# Altium schematic sheet ne5555.schdoc
size A4
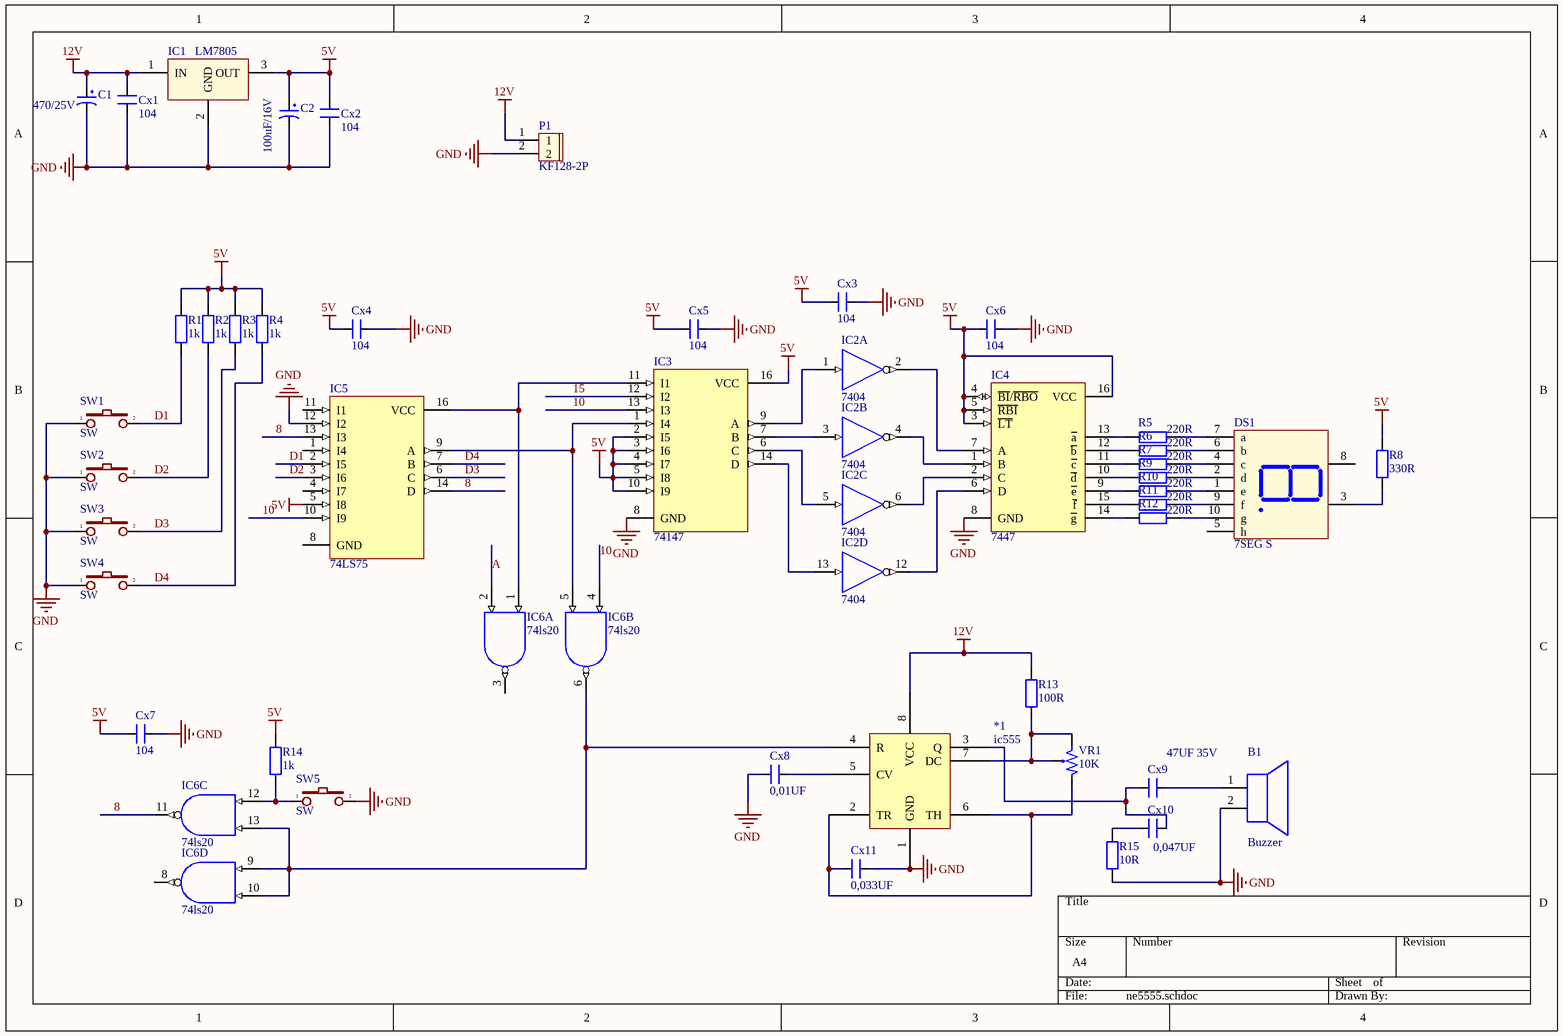
[diagram p0: ne5555.schdoc]

## Parts
*1  ic555  [DIP8/W0.3]
B1  Buzzer  [Buzzer]
C1  470/25V  [CP1.5/3.4]
C2  100uF/16V  [CP1.5/3.4]
Cx1  104  [CN1]
Cx2  104  [CN1]
Cx3  104  [CN1]
Cx4  104  [CN1]
Cx5  104  [CN1]
Cx6  104  [CN1]
Cx7  104  [CN1]
Cx8  0,01UF  [CN1]
Cx9  47UF 35V  [CN1]
Cx10  0,047UF  [CN1]
Cx11  0,033UF  [CN1]
DS1  7SEG S  [7SEGS]
IC1  LM7805  [QTO-220]
IC2  7404  [DIP14/W0.3]  (parts A,B,C,D of 6)
IC3  74147  [DIP16/W0.3]
IC4  7447  [DIP16/W0.3]
IC5  74LS75  [DIP16/W0.3]
IC6  74ls20  [DIP14/W0.3]  (parts A,B,C,D of 4)
P1  KF128-2P  [con 2 kf128]
R1  1k  [R1/4W]
R2  1k  [R1/4W]
R3  1k  [R1/4W]
R4  1k  [R1/4W]
R5  220R  [R1/4W]
R6  220R  [R1/4W]
R7  220R  [R1/4W]
R8  330R  [R1/4W]
R9  220R  [R1/4W]
R10  220R  [R1/4W]
R11  220R  [R1/4W]
R12  220R  [R1/4W]
R13  100R  [R1/4W]
R14  1k  [R1/4W]
R15  10R  [R1/4W]
SW1  SW  [SW2]
SW2  SW  [SW2]
SW3  SW  [SW2]
SW4  SW  [SW2]
SW5  SW  [SW2]
VR1  10K  [VR1]

## Nets
5V: C2.1 Cx2.2 Cx3.2 Cx4.2 Cx5.2 Cx6.2 Cx7.2 IC1.3(OUT) IC3.2(I5) IC3.3(I6) IC3.4(I7) IC3.5(I8) IC3.10(I9) IC3.16(VCC) IC4.3(~{LT}) IC4.4(~{BI}/~{RBO}) IC4.5(~{RBI}) IC4.16(VCC) IC5.5(I8) R1.2 R2.2 R3.2 R4.2 R8.2 R14.2
12V: *1.8(VCC) C1.1 Cx1.2 IC1.1(IN) P1.1 R13.2
GND: *1.1(GND) B1.2(-) C1.2 C2.2 Cx1.1 Cx2.1 Cx3.1 Cx4.1 Cx5.1 Cx6.1 Cx7.1 Cx8.2 Cx11.1 IC1.2(GND) IC2.7(GND) IC3.8(GND) IC4.8(GND) IC5.12(I2) IC6.7(GND) P1.2 R15.1 SW1.1 SW2.1 SW3.1 SW4.1 SW5.2
VCC: IC2.14(VCC) IC6.14(VCC)
8: IC5.13(I3) IC5.14(D) IC6.11(~{O})
10: IC3.13(I3) IC5.10(I9) IC6.4(A)
15: IC3.12(I2)
A: IC6.2(B)
D1: IC5.2(I5) R1.1 SW1.2
D2: IC5.3(I6) R2.1 SW2.2
D3: IC5.6(C) R3.1 SW3.2
D4: IC5.7(B) R4.1 SW4.2
Net*1_2: *1.2(TR) *1.6(TH) Cx11.2 VR1.1
Net*1_3: *1.3(Q) Cx9.1 Cx10.2
Net*1_4: *1.4(R) IC6.6(~{O}) IC6.9(B) IC6.10(A) IC6.13(A)
Net*1_5: *1.5(CV) Cx8.1
Net*1_7: *1.7(DC) R13.1 VR1.2 VR1.3
NetB1_1: B1.1(+) Cx9.2
NetCx10_1: Cx10.1 R15.2
NetDS1_1: DS1.1(e) R10.2
NetDS1_2: DS1.2(d) R9.2
NetDS1_3: DS1.3(Vcc) R8.1
NetDS1_4: DS1.4(c) R7.2
NetDS1_6: DS1.6(b) R6.2
NetDS1_7: DS1.7(a) R5.2
NetDS1_9: DS1.9(f) R11.2
NetDS1_10: DS1.10(g) R12.2
NetIC2_1: IC2.1(A) IC3.9(A)
NetIC2_2: IC2.2(~{O}) IC4.7(A)
NetIC2_3: IC2.3(A) IC3.7(B)
NetIC2_4: IC2.4(~{O}) IC4.1(B)
NetIC2_5: IC2.5(A) IC3.6(C)
NetIC2_6: IC2.6(~{O}) IC4.2(C)
NetIC2_12: IC2.12(~{O}) IC4.6(D)
NetIC2_13: IC2.13(A) IC3.14(D)
NetIC3_1: IC3.1(I4) IC5.9(A) IC6.5(B)
NetIC3_11: IC3.11(I1) IC5.16(VCC) IC6.1(A)
NetIC4_9: IC4.9(~{e}) R10.1
NetIC4_10: IC4.10(~{d}) R9.1
NetIC4_11: IC4.11(~{c}) R7.1
NetIC4_12: IC4.12(~{b}) R6.1
NetIC4_13: IC4.13(~{a}) R5.1
NetIC4_14: IC4.14(~{g}) R12.1
NetIC4_15: IC4.15(~{f}) R11.1
NetIC6_12: IC6.12(B) R14.1 SW5.1

Not connected (* = marked no-connect by the designer): DS1 5(h) 8(Vcc); IC5 1(I4) 4(I7) 8(GND) 11(I1); IC6 3(~{O}) 8(~{O})

## Library data of the parts
C1 C2 = CP4: Cap 1000uF/16V - 220uF/50V; Description 5: 4,7uF>10uF/250V_3,3uF>10uF/400V - 2,2uF>4,7uF/450V; Description 1: 2200uF-3300uF/6,3V - 1000uF-2200uF/10V; Description 2: 1000uF/16V - 470uF => 1000uF/25V - 100uF/100V; Description 3: 330uF>470uF/35V_220uF>470uF/50V_10uF>22uF/250V; Description 4: 220uF => 330uF/63V - 10uF =>33uF/160 - 200V; Value: 1000uF/16V
Cx1-Cx11 = CN0: Cremic For Xtal 1pF => 100pF; Value: 33pF
DS1 = LED7S: Single 7 Seg Dipslay; Value: LED 7S SEG
IC1 = LM78xx: On ap +, from + 5 to + 24VDC; Value: LM7805
IC2 = 7404: Hex Inverter; Code_IPC: SOIC127P600-14; ComponentLink1Description: Manufacturer Link; ComponentLink1URL: http://www.national.com/; ComponentLink2Description: Datasheet; ComponentLink2URL: http://www.fairchildsemi.com/ds/74/74F04.pdf; Value: 7404
IC3 IC5 = 74147: 10-Line to 4-Line Priority Encoder; Copyright by: VanDungEvn@Gmail.com
IC4 = 7447: BCD to 7-Segment Decoder/Driver; Value: 7447 , 74247
IC6 = 7400: Quad 2-Input NAND Gate; Value: 7400; Value: DIP14/W0.3; Copyright by: VanDungEvn@Gmail.com
P1 = Con 2 kf128: Cắm; So_Chan: 2; Ten_Linh_Kien: CON 2 KF128-2P 5.08MM; Ma_Hang: MH000982; Don_Vi: Con; Chung_Loai: Cắm; Kieu_Chan: *
R1-R15 = R1/4W: Resistor 1/4W; Value: R1/4W - 1K
SW1-SW5 = SW2: Switch button 2 pin; Value: SW chip 2 pin
VR1 = VR1: Var Resistor; Value: VR 10K